# EasyEDA Pro project ProPrj_transverter-front-end_2026-04-14.epro, board 2-PCB_PCB_transverter-control-board
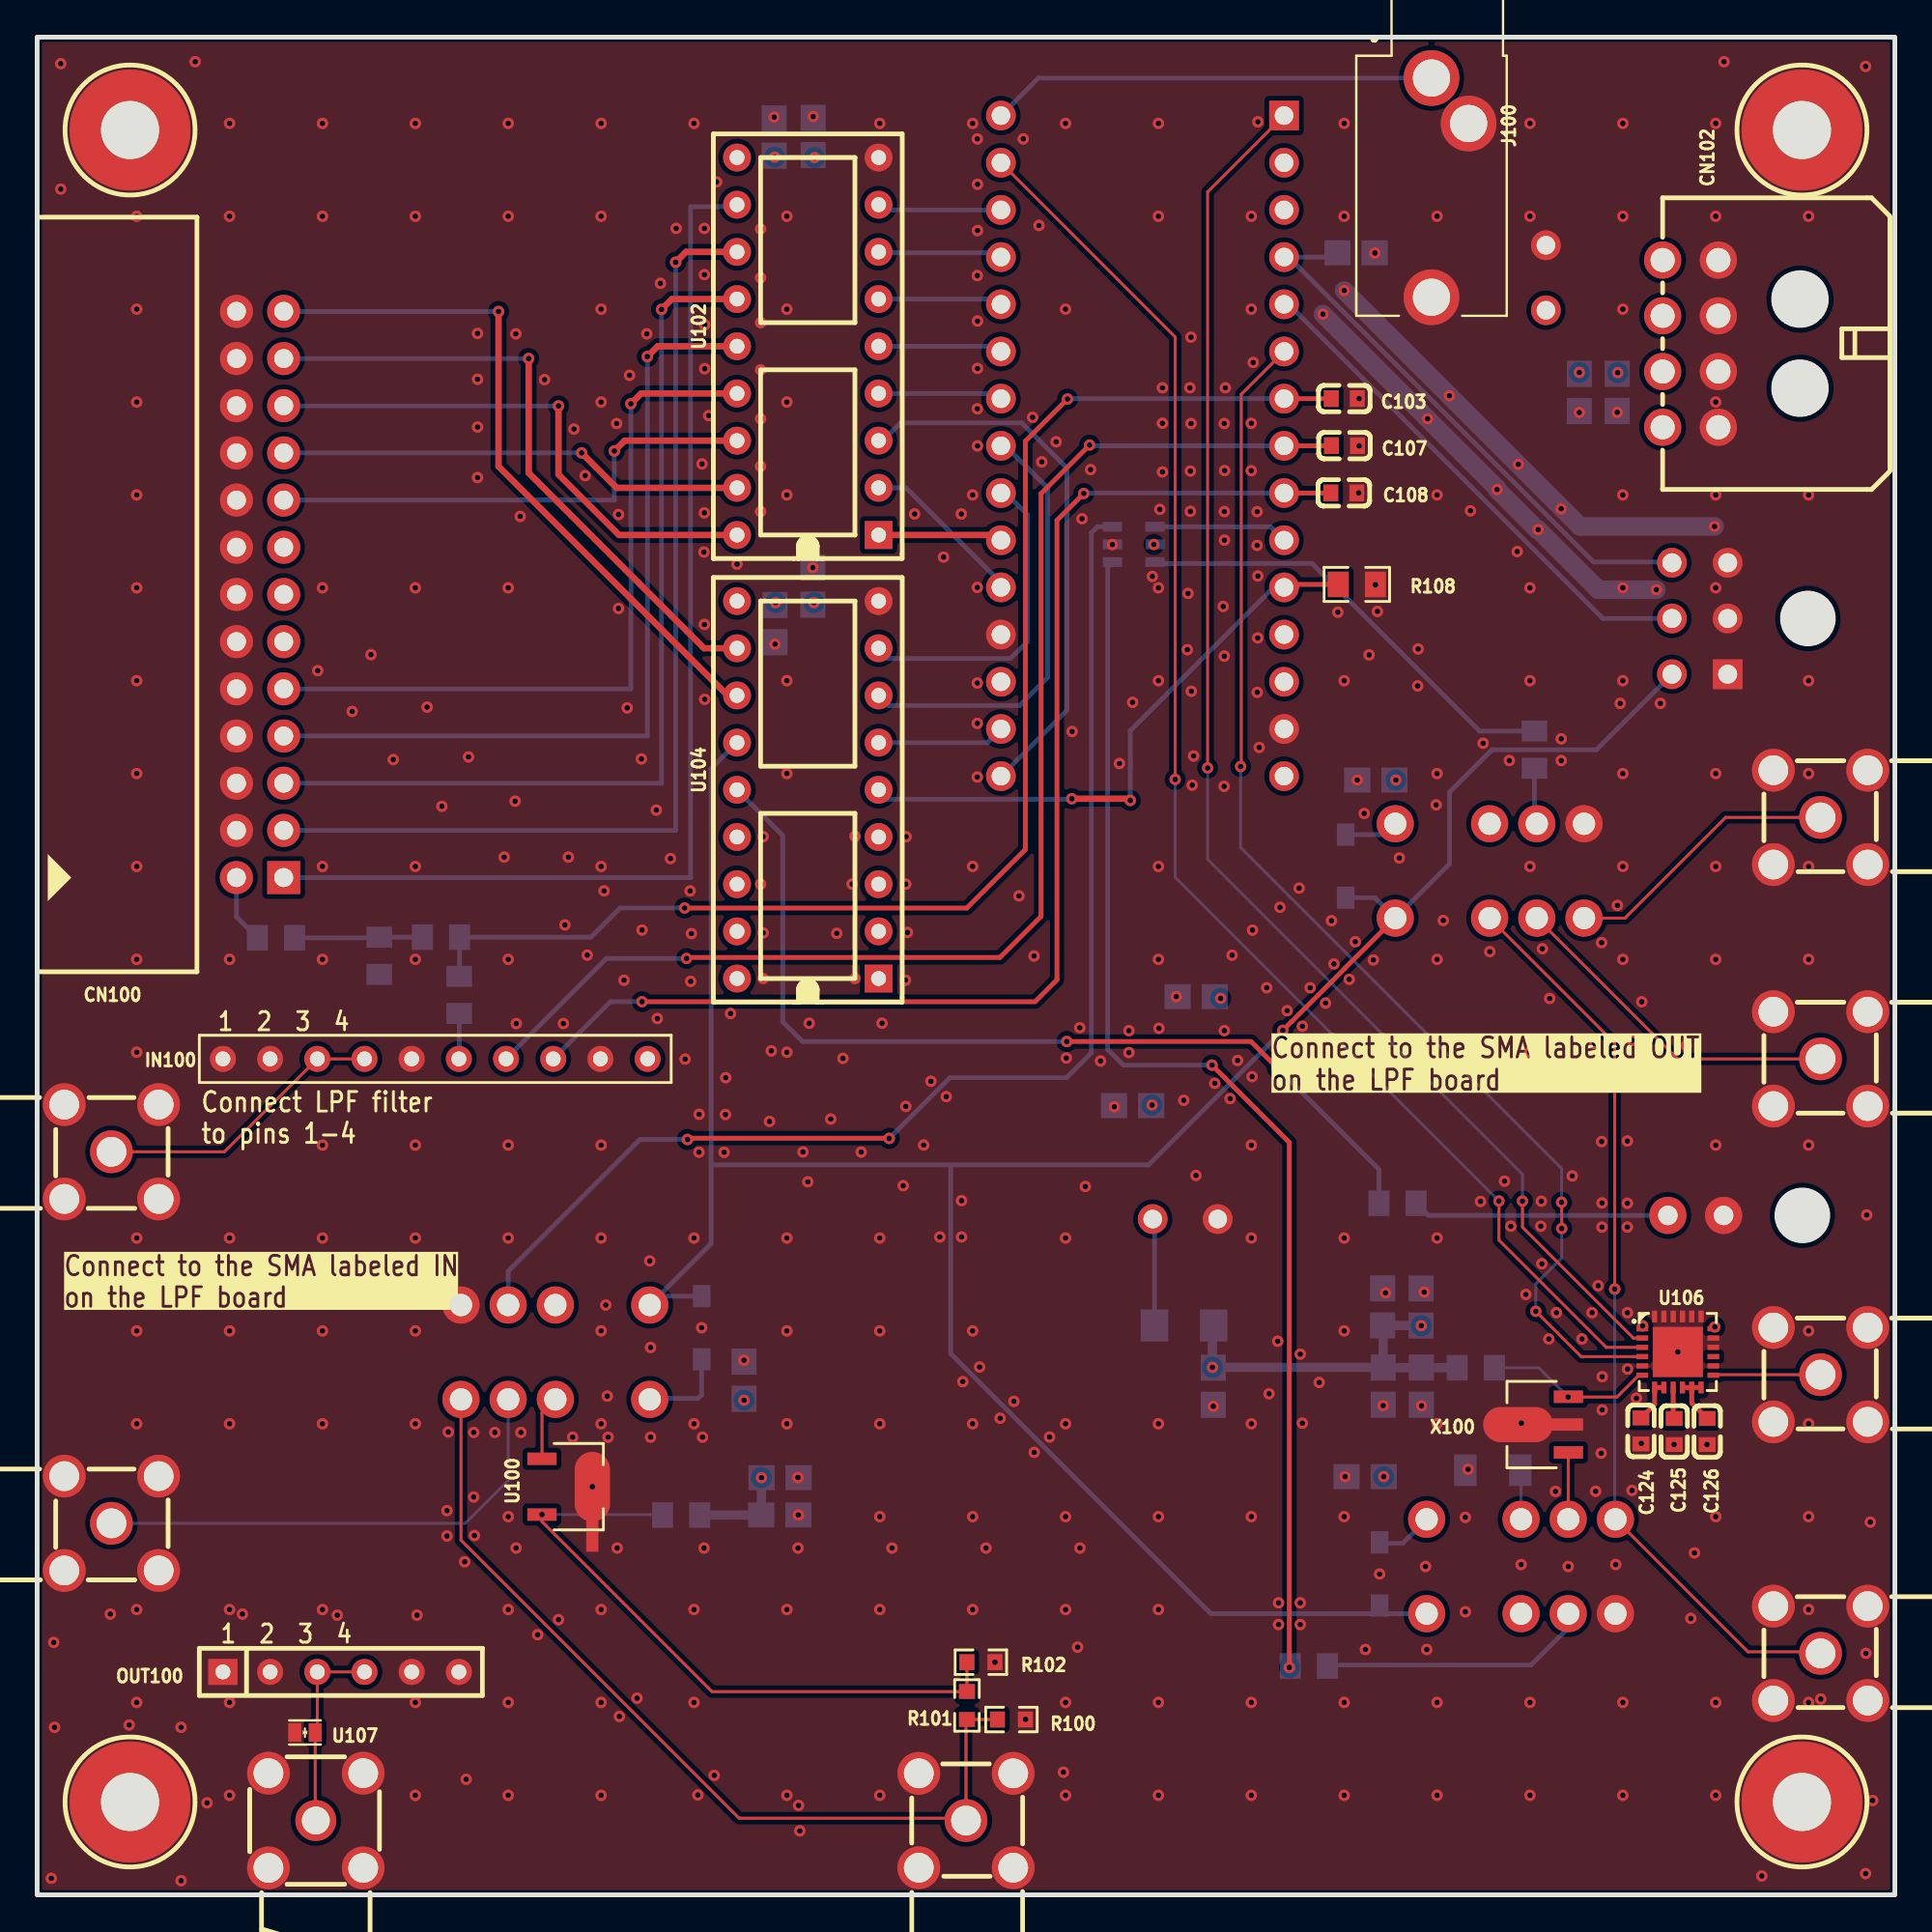
[diagram p11: board, top side]
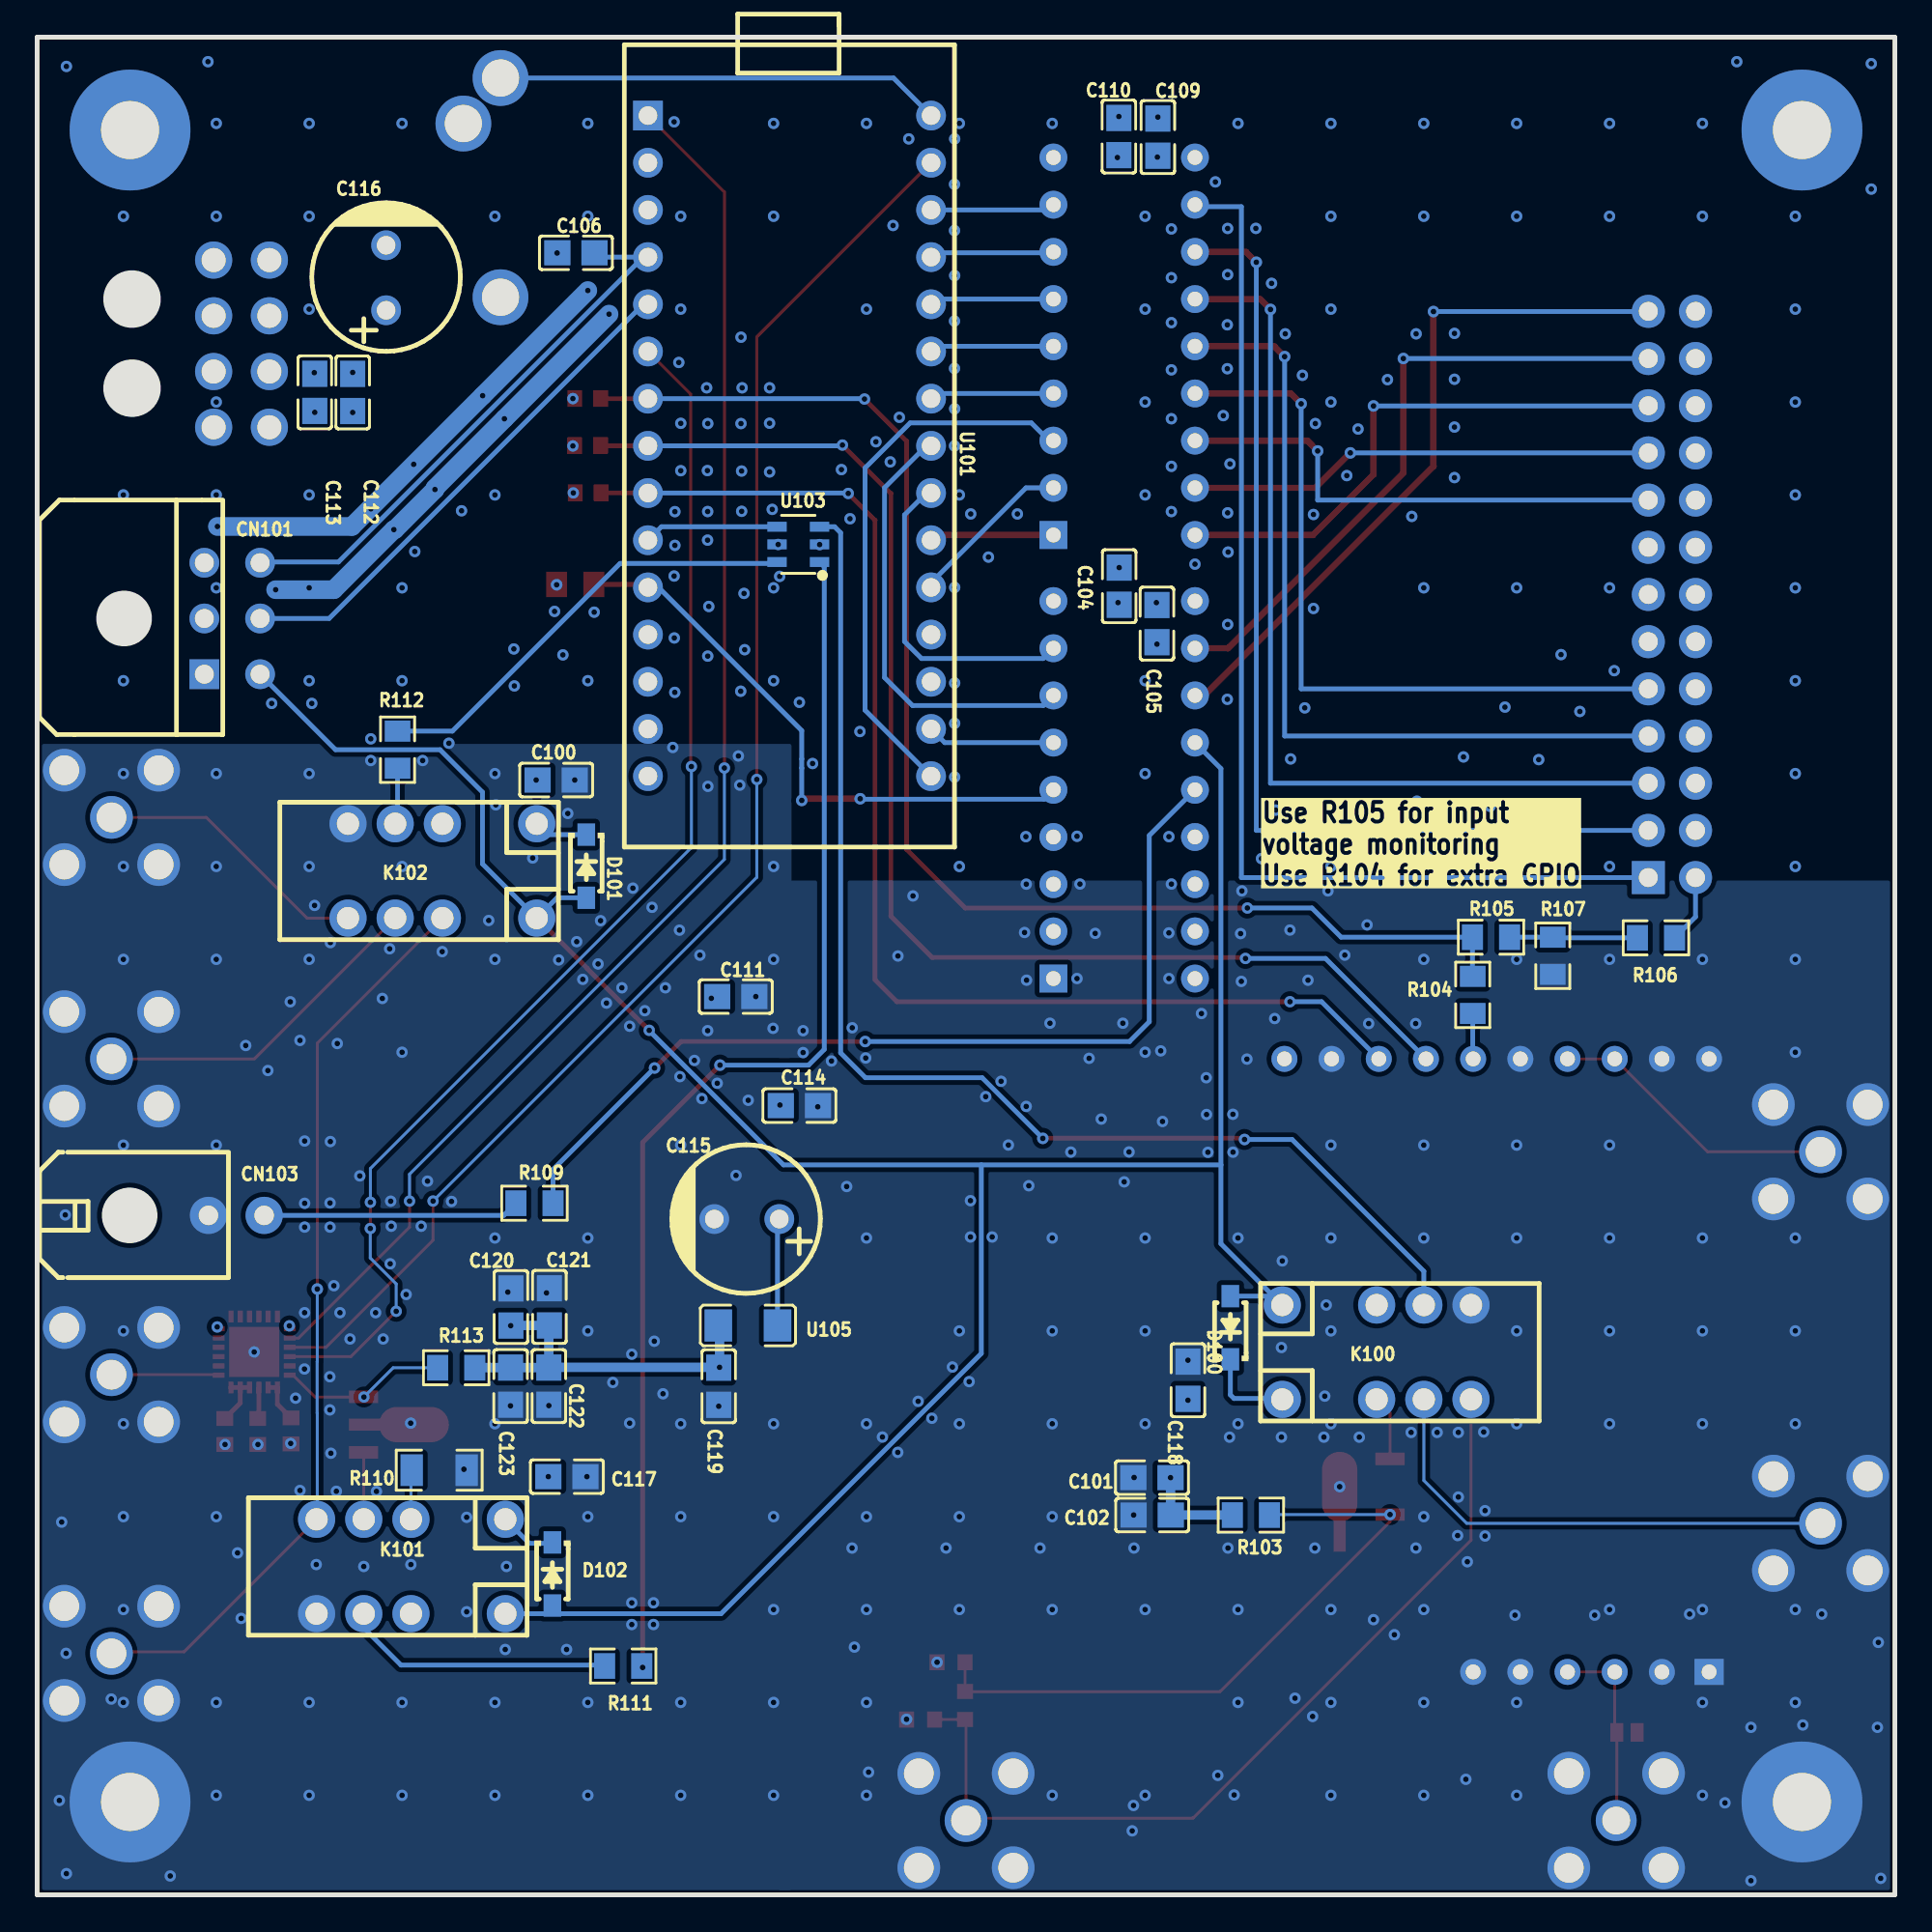
[diagram p12: board, bottom side, seen from below]

Outline 100 x 100 mm; copper layers: Top Layer, Inner1, Inner2, Bottom Layer. Coordinates in mm from the lower left corner of the outline.
Outline path: 0,100 100,100 100,0 0,0 0,100
Stack: Top Layer 0.035mm / Dielectric1 0.48mm PP er 4.5 / Inner1 0.035mm / Dielectric2 0.48mm FR4 er 4.5 / Inner2 0.035mm / Dielectric3 0.48mm PP er 4.5 / Bottom Layer 0.035mm

## Design rules (mm)
net PA-ENABLE-2: control_lines
net PA-ENABLE: control_lines
net RLY-TXRX-EN: control_lines
net TO-BPF: RF
net LO-BPF-SENSE: control_lines
net PA-OUT-SENSE: control_lines
net FROM-BPF: RF
net RLY-5-EN: control_lines
net RLY-4-EN: control_lines
net RLY-3-EN: control_lines
net RLY-2-EN: control_lines
net RLY-1-EN: control_lines
net RLY-6-EN: control_lines
net RLY-7-EN: control_lines
net RLY-8-EN: control_lines
net RLY-9-EN: control_lines
net RLY-10-EN: control_lines
net PA-IN-SENSE: control_lines
net TO-LO: RF
net TO-LPF: RF
net PA-OUTPUT: RF
net FROM-LPF: RF
net TO-ANTENNA: RF
net PA-INPUT-TERMINATION: RF
net LO-BPF-AMP-IN: RF
net LO-BPF-AMP-OUT: RF
net PA-PREAMP-IN: RF
net EXPANSION3: control_lines
net EXPANSION2: control_lines
net EXPANSION1: control_lines
template: User Custom Config
spacing Default (default): track to track 0.152, other pairs 0 to 0.152
spacing RF: track to track 1, other pairs 0 to 0.65
spacing clean_voltage: track to track 0.152, other pairs 0.152 to 0.3
spacing control_lines: track to track 0.5, other pairs 0.152 to 0.3
spacing ground_guard: track to track 0.3, other pairs 0.2 to 0.3
spacing main_power: track to track 2, other pairs 0.152 to 0.3
spacing relay_power: track to track 1, other pairs 0.152 to 0.3
spacing small_components: track to track 0.152, other pairs 0.152 to 0.3
spacing small_power: track to track 0.6, other pairs 0.152 to 0.3
track width Default (default): min 0.254, default 0.254, max 25.4
track width RF: min 0.157, default 0.157, max 0.157
track width control_lines: min 0.25, default 0.25, max 0.26
track width main_power: min 1.5, default 1.5, max 3
track width relay_power: min 1, default 1, max 1.25
track width small_power: min 0.5, default 0.5, max 2.54
differential pair differentialPair (default): width min 0.127, default 0.254, max 2.54; gap min 0.152, default 0.152
via Default (default): diameter min 0.61, default 0.61, max 100.025; hole min 0.305, default 0.305, max 59.995
via RF: diameter min 0.61, default 0.61, max 100.025; hole min 0.305, default 0.305, max 59.995
net class control_lines uses control_lines
net class RF uses RF
net GND uses direct
net PA-ENABLE-2 uses control_lines
net PA-ENABLE uses control_lines
net RLY-TXRX-EN uses control_lines
net LO-TRIM uses control_lines
net TO-BPF uses RF
net LO-BPF-SENSE uses control_lines
net PA-OUT-SENSE uses control_lines
net FROM-BPF uses RF
net PA-INPUT uses RF
net RLY-5-EN uses control_lines
net RLY-4-EN uses control_lines
net RLY-3-EN uses control_lines
net RLY-2-EN uses control_lines
net RLY-1-EN uses control_lines
net RLY-6-EN uses control_lines
net RLY-7-EN uses control_lines
net RLY-8-EN uses control_lines
net RLY-9-EN uses control_lines
net RLY-10-EN uses control_lines
net PA-IN-SENSE uses control_lines
net TO-LO uses RF
net TO-LPF uses RF
net PA-OUTPUT uses RF
net FROM-LPF uses RF
net TO-ANTENNA uses RF
net PA-INPUT-TERMINATION uses RF
net LO-BPF-AMP-IN uses RF
net LO-BPF-AMP-OUT uses RF
net PA-PREAMP-IN uses RF
net PA-PREAMP-OUT uses RF
net SPI-CLK uses RF, small_components
net SPI-CS1 uses RF, small_components
net SPI-MOSI uses RF, small_components
net CONDITIONED-5V uses small_power
net EXPANSION3 uses control_lines
net EXPANSION2 uses control_lines
net EXPANSION1 uses control_lines
['net class', 'rf'] ['NET', 'GND'] uses ground_guard

## Placement (name value [footprint] x y rotation side)
C100  100nF  [C0805]  72.06 60.01 180 bottom
C101  100nF  [C0805]  39.99 22.46 0 bottom
C102  1nF  [C0805]  39.98 20.45 180 bottom
C103  100nF  [C0603]  70.36 80.54 180 top
C104  1nF  [C0805]  41.75 70.45 270 bottom
C105  100nF  [C0805]  39.72 68.43 270 bottom
C106  10nF  [C0805]  71 88.39 0 bottom
C107  100nF  [C0603]  70.37 78.01 180 top
C108  100nF  [C0603]  70.34 75.47 180 top
C109  1nF  [C0805]  39.67 94.62 270 bottom
C110  100nF  [C0805]  41.77 94.65 90 bottom
C111  1nF  [C0805]  62.39 48.35 0 bottom
C112  1uF  [C0805]  83.02 80.87 270 bottom
C113  1nF  [C0805]  85.06 80.88 90 bottom
C114  1uF  [C0805]  58.97 42.49 180 bottom
C115  47 µF  [CAP-TH_BD8.0-P3.50-D0.6-FD]  61.8 36.38 0 bottom
C116  47 µF  [CAP-TH_BD8.0-P3.50-D0.6-FD]  81.22 87.05 90 bottom
C117  100nF  [C0805]  71.48 22.51 180 bottom
C118  100nF  [C0805]  38.05 27.7 90 bottom
C119  10uF  [C0805]  63.31 27.38 90 bottom
C120  1nF  [C0805]  74.5 31.64 270 bottom
C121  100nF  [C0805]  72.43 31.65 90 bottom
C122  1nF  [C0805]  72.46 27.38 90 bottom
C123  100nF  [C0805]  74.51 27.38 270 bottom
C124  330pF  [C0603]  86.33 24.97 90 top
C125  330pF  [C0603]  88.12 24.94 90 top
C126  330pF  [C0603]  89.9 24.94 90 top
CN100  SBH11-PBPC-D13-RA-BK  [IDC-TH_26P-P2.54-H-M-R2-C13-W8.8]  12 70 270 top
CN101  430450602  [CONN-TH_6P-P3.00_43045-0600]  89.5 68.71 270 bottom
CN102  4x2 Connector  [CONN-TH_0430450800]  89 83.5 90 top
CN103  1x2 Connector  [CONN-TH_43045-0200]  89.28 36.58 270 bottom
D100  1N4148W-7-F  [SOD-123_L2.7-W1.6-LS3.7-RD-1]  35.77 30.53 90 bottom
D101  1N4148W-7-F  [SOD-123_L2.7-W1.6-LS3.7-RD-1]  70.44 55.37 270 bottom
D102  1N4148W-7-F  [SOD-123_L2.7-W1.6-LS3.7-RD-1]  72.26 17.27 270 bottom
IN100  X5511FV-10-C30D743-0743  [HDR-TH_10P-P2.54-V-F-S2.54]  21.43 45 0 top
J100  footswitch_in  [SWITCHCRAFT_35RAPC2AVN4]  75.06 94 270 top
K100  TX2-5V  [RELAY-TH_TX2-3V]  27.89 29.21 180 bottom
K101  TX2-5V  [RELAY-TH_TX2-3V]  79.88 17.68 0 bottom
K102  TX2-5V  [RELAY-TH_TX2-3V]  78.19 55.12 0 bottom
NOREF  -  [Pad_e3389]  95 5 0 top
NOREF#2  -  [Pad_e3391]  5 95 0 top
NOREF#3  -  [Pad_e3390]  95 95 0 top
NOREF#4  -  [Pad_e2279]  5 5 0 top
OUT100  X5511FV-06-C30D743-0743  [HDR-TH_6P-P2.54_X5511FV-06-C30D743-0743]  16.35 12 0 top
R100  71.5Ω  [R0603_NEW]  52.45 9.44 180 top
R101  137Ω  [R0603_NEW]  50.05 10.19 270 top
R102  71.5Ω  [R0603_NEW]  50.8 12.52 180 top
R103  0Ω  [R0805]  34.66 20.44 0 bottom
R104  0Ω  [R0805]  22.72 48.44 90 bottom
R105  0Ω  [R0805]  21.74 51.55 0 bottom
R106  22kΩ  [R0805]  12.86 51.52 180 bottom
R107  10kΩ  [R0805]  18.41 50.55 90 bottom
R108  100k  [R0805]  71.04 70.54 0 top
R109  100  [R0805]  73.23 37.23 0 bottom
R110  50Ω  [R1206]  78.36 22.86 0 bottom
R111  1k  [R0805]  68.45 12.32 180 bottom
R112  1k  [R0805]  80.6 61.64 270 bottom
R113  0Ω  [R0805]  77.44 28.37 180 bottom
SMA100  LO  [ANT-TH_SMA-J-P-H-RA-TH1]  50 4 90 top
SMA101  BPF-IN  [ANT-TH_SMA-J-P-H-RA-TH1]  4 20 0 top
SMA102  BPF-OUT  [ANT-TH_SMA-J-P-H-RA-TH1]  96 13 180 top
SMA103  LPF-IN  [ANT-TH_SMA-J-P-H-RA-TH1]  96 45 180 top
SMA104  LPF-OUT  [ANT-TH_SMA-J-P-H-RA-TH1]  4 40 0 top
SMA105  ANTENNA  [SMA-TH_CONSMA002-L-G]  15 4 270 top
SMA106  PA-IN  [ANT-TH_SMA-J-P-H-RA-TH1]  96 28 180 top
SMA107  PA-OUT  [ANT-TH_SMA-J-P-H-RA-TH1]  96 58 180 top
U100  GALI-74+  [SOT-89-3_L4.5-W2.5-P1.50-LS4.2-BR]  28.53 21.97 180 top
U101  ABX00142  [ARDUINO-TH_L43.2-W17.8-P2.54-LS15.24-BL]  59.5 78 270 bottom
U102  4818-3000-CP  [DIP-18_L22.9-W10.2-P2.54-LS7.6-BL_100-183-100-1001-00]  41.48 83.36 90 top
U103  74LVC1G11W6-7  [SOT-26_L3.0-W1.6-P0.95-LS2.8-BL]  59.03 72.7 90 bottom
U104  4818-3000-CP  [DIP-18_L22.9-W10.2-P2.54-LS7.6-BL_100-183-100-1001-00]  41.48 59.48 90 top
U105  BLM31PG601SH1L  [L1206]  61.74 30.65 0 bottom
U106  HMC792ALP4E  [QFN-24_L4.0-W4.0-P0.50-TL-EP2.7]  88.32 29.22 0 top
U107  CPDUR5V0R-HF  [SOD-523F_L1.7-W1.0-BI]  14.42 8.74 0 top
X100  GALI-52+  [SOT-89-3_L4.5-W2.5-P1.50-LS4.2-BR#2]  81.07 25.31 0 top

## Footprints (pads in the part's own frame, mm; a bottom-side part is the same pattern mirrored in y, then rotated)
ANT-TH_SMA-J-P-H-RA-TH1
  round 2.3 hole 1.6: 1(-2.54,2.54) 2(2.54,2.54) 3(2.54,-2.54) 4(-2.54,-2.54) 5(0,0)
ARDUINO-TH_L43.2-W17.8-P2.54-LS15.24-BL
  rect 1.6x1.6 hole 1: 1(-17.78,-7.62)
  round 1.6 hole 1: 2(-15.24,-7.62) 3(-12.7,-7.62) 4(-10.16,-7.62) 5(-7.62,-7.62) 6(-5.08,-7.62) 7(-2.54,-7.62) 8(0,-7.62) 9(2.54,-7.62) 10(5.08,-7.62) 11(7.62,-7.62) 12(10.16,-7.62) 13(12.7,-7.62) 14(15.24,-7.62) 15(17.78,-7.62) 16(17.78,7.62) 17(15.24,7.62) 18(12.7,7.62) 19(10.16,7.62) 20(7.62,7.62) 21(5.08,7.62) 22(2.54,7.62) 23(0,7.62) 24(-2.54,7.62) 25(-5.08,7.62) 26(-7.62,7.62) 27(-10.16,7.62) 28(-12.7,7.62) 29(-15.24,7.62) 30(-17.78,7.62)
C0603
  rect 0.8x0.9 smd: 1(-0.7,0) 2(0.7,0)
C0805
  rect 1.41x1.35 smd: 1(-1,0) 2(1,0)
CAP-TH_BD8.0-P3.50-D0.6-FD
  round 1.6 hole 1: 1(-1.75,0) 2(1.75,0)
CONN-TH_6P-P3.00_43045-0600
  rect 1.6x1.6 hole 1.02: 1(3,-1.5)
  round 1.6 hole 1.02: 2(0,-1.5) 3(-3,-1.5) 4(3,1.5) 5(0,1.5) 6(-3,1.5)
CONN-TH_43045-0200
  round 2 hole 1.05: 1(0,-1.5) 2(0,1.5)
CONN-TH_0430450800
  round 2 hole 1.3: 1(4.5,-1.5) 2(1.5,-1.5) 3(-1.5,-1.5) 4(-4.5,-1.5) 5(4.5,1.5) 6(1.5,1.5) 7(-1.5,1.5) 8(-4.5,1.5)
DIP-18_L22.9-W10.2-P2.54-LS7.6-BL_100-183-100-1001-00
  rect 1.5x1.5 hole 0.8: 1(-10.16,-3.81)
  round 1.5 hole 0.8: 2(-7.62,-3.81) 3(-5.08,-3.81) 4(-2.54,-3.81) 5(0,-3.81) 6(2.54,-3.81) 7(5.08,-3.81) 8(7.62,-3.81) 9(10.16,-3.81) 10(10.16,3.81) 11(7.62,3.81) 12(5.08,3.81) 13(2.54,3.81) 14(0,3.81) 15(-2.54,3.81) 16(-5.08,3.81) 17(-7.62,3.81) 18(-10.16,3.81)
HDR-TH_6P-P2.54_X5511FV-06-C30D743-0743
  rect 1.575x1.4 hole 0.8: 1(-6.35,0)
  round 1.4 hole 0.8: 2(-3.81,0) 3(-1.27,0) 4(1.27,0) 5(3.81,0) 6(6.35,0)
HDR-TH_10P-P2.54-V-F-S2.54
  round 1.4 hole 0.8: 1(-11.43,0) 2(-8.89,0) 3(-6.35,0) 4(-3.81,0) 5(-1.27,0) 6(1.27,0) 7(3.81,0) 8(6.35,0) 9(8.89,0) 10(11.43,0)
IDC-TH_26P-P2.54-H-M-R2-C13-W8.8
  rect 1.778x1.778 hole 1.02: 1(15.24,1.27)
  round 1.778 hole 1.02: 2(15.24,-1.27) 3(12.7,1.27) 4(12.7,-1.27) 5(10.16,1.27) 6(10.16,-1.27) 7(7.62,1.27) 8(7.62,-1.27) 9(5.08,1.27) 10(5.08,-1.27) 11(2.54,1.27) 12(2.54,-1.27) 13(0,1.27) 14(0,-1.27) 15(-2.54,1.27) 16(-2.54,-1.27) 17(-5.08,1.27) 18(-5.08,-1.27) 19(-7.62,1.27) 20(-7.62,-1.27) 21(-10.16,1.27) 22(-10.16,-1.27) 23(-12.7,1.27) 24(-12.7,-1.27) 25(-15.24,1.27) 26(-15.24,-1.27)
L1206
  rect 1.485x1.728 smd: 1(-1.593,0) 2(1.593,0)
Pad_e2279
  round 6.5 hole 3.125: 1(0,0)
Pad_e3389
  round 6.5 hole 3.125: 1(0,0)
Pad_e3390
  round 6.5 hole 3.125: 1(0,0)
Pad_e3391
  round 6.5 hole 3.125: 1(0,0)
QFN-24_L4.0-W4.0-P0.50-TL-EP2.7
  rect 0.633x0.28 smd: 1(-1.911,1.25) 2(-1.911,0.75) 3(-1.911,0.25) 4(-1.911,-0.25) 5(-1.911,-0.75) 6(-1.911,-1.25) 13(1.911,-1.25) 14(1.911,-0.75) 15(1.911,-0.25) 16(1.911,0.25) 17(1.911,0.75) 18(1.911,1.25)
  rect 0.28x0.633 smd: 7(-1.25,-1.911) 8(-0.75,-1.911) 9(-0.25,-1.911) 10(0.25,-1.911) 11(0.75,-1.911) 12(1.25,-1.911) 19(1.25,1.911) 20(0.75,1.911) 21(0.25,1.911) 22(-0.25,1.911) 23(-0.75,1.911) 24(-1.25,1.911)
  rect 2.7x2.7 smd: 25(0,0)
R0603_NEW
  rect 0.806x0.864 smd: 1(-0.753,0) 2(0.753,0)
R0805
  rect 1.133x1.377 smd: 1(-1,0) 2(1,0)
R1206
  rect 1.208x1.701 smd: 1(-1.479,0) 2(1.479,0)
RELAY-TH_TX2-3V
  round 2 hole 1.2: 1(-5.08,-2.54) 3(0,-2.54) 4(2.54,-2.54) 5(5.08,-2.54) 8(5.08,2.54) 9(2.54,2.54) 10(0,2.54) 12(-5.08,2.54)
SMA-TH_CONSMA002-L-G
  round 2.2 hole 1.5: 1(0,0)
  round 2.3 hole 1.6: 2(-2.55,2.55) 3(-2.55,-2.55) 4(2.55,-2.55) 5(2.55,2.55)
SOD-123_L2.7-W1.6-LS3.7-RD-1
  rect 1.2x0.95 smd: 1(-1.7,0) 2(1.7,0)
SOD-523F_L1.7-W1.0-BI
  rect 0.7x1 smd: 1(-0.55,0) 2(0.55,0)
SOT-26_L3.0-W1.6-P0.95-LS2.8-BL
  rect 0.532x1.04 smd: 1(-0.95,-1.145) 2(0,-1.145) 3(0.95,-1.145) 4(0.95,1.145) 5(0,1.145) 6(-0.95,1.145)
SOT-89-3_L4.5-W2.5-P1.50-LS4.2-BR
  rect 1.575x0.672 smd: 1(1.356,-1.5) 3(1.356,1.5)
  custom 1.9x5.377 smd: 2(-1.356,0)
SOT-89-3_L4.5-W2.5-P1.50-LS4.2-BR#2
  rect 1.575x0.672 smd: 1(1.356,-1.5) 3(1.356,1.5)
  custom 5.377x1.9 smd: 2(-1.356,0)
SWITCHCRAFT_35RAPC2AVN4
  round 3 hole 2.005x2: 1(-3.8,0) 2(-1.35,2) 5(8,0)

## Nets
As in the schematic, except:
GND: C100.2 C101.2 C102.1 C103.1 C104.1 C105.2 C106.2 C107.1 C108.1 C109.1 C110.2 C111.1 C112.2 C113.1 C114.2 C115.2 C116.2 C117.2 C118.2 C119.1 C120.1 C121.2 C122.1 C123.2 C124.1 C125.1 C126.1 CN100.4 CN100.6 CN100.8 CN100.10 CN100.12 CN100.14 CN100.16 CN100.18 CN100.20 CN100.22 CN100.24 CN100.26 CN101.1 CN101.2 CN101.3 CN102.1 CN102.2 CN102.3 CN102.4 CN103.1 IN100.1 IN100.2 IN100.5 IN100.9 J100.2 J100.5 K100.8 K101.8 K102.5 NOREF.1 NOREF#2.1 NOREF#3.1 NOREF#4.1 OUT100.1 OUT100.2 OUT100.5 OUT100.6 R100.1 R102.1 R107.1 R108.2 R110.1 SMA100.1 SMA100.2 SMA100.3 SMA100.4 SMA101.1 SMA101.2 SMA101.3 SMA101.4 SMA102.1 SMA102.2 SMA102.3 SMA102.4 SMA103.1 SMA103.2 SMA103.3 SMA103.4 SMA104.1 SMA104.2 SMA104.3 SMA104.4 SMA105.2 SMA105.3 SMA105.4 SMA105.5 SMA106.1 SMA106.2 SMA106.3 SMA106.4 SMA107.1 SMA107.2 SMA107.3 SMA107.4 U100.2 U101.14 U101.19 U102.9 U103.2 U104.9 U106.5 U106.14 U106.16 U106.17 U106.19 U106.20 U106.21 U106.22 U106.23 U106.24 U106.25 U107.1 X100.2

Pads without a net: CN102 5 6; U101 2 3 13 15 18; U104 1 2 3 4 15 16 17 18; U106 15

## Via types
v1: diameter 0.61, hole 0.305, Top Layer to Bottom Layer, 575 vias
v2: diameter 0.62, hole 0.31, Top Layer to Bottom Layer, 28 vias

## Routing (per net, layer and track width the routed paths; a pad name or vN(x,y) marks a point on that pad's centre or on a via; arc(x,y) is an arc through that point)
2.5V-REF-EN: length 27.9
  Bottom Layer w0.254: U101.5 67.37,85.62 84.28,68.71 CN101.5
12V-SENSE: length 6.9
  Bottom Layer w0.254: R106.1 18.38,51.52 R107.2 20.74,51.55 R105.1
GND: length 49.3
  Bottom Layer w1: v1(70.36,86.36) v1(76.02,80.7) 83.06,73.66 v1(90.3,73.66) ; v1(69.22,85.09) v1(74.85,79.46) 78.59,75.72 v1(78.59,75.65) 80.74,73.49 v1(80.8,73.49) 84.03,70.26 v1(87.16,70.26)
  vias: v1(0.76,0.89) v1(0.89,13.59) v1(0.94,9.02) v1(1.27,98.57) v1(1.27,91.82) v1(3.94,15.11) v1(4.95,9.14) v1(5.36,90.36) v1(5.36,85.36) v1(5.36,80.36) v1(5.36,75.36) v1(5.36,70.36) v1(5.36,65.36) v1(5.36,60.36) v1(5.36,55.36) v1(5.36,50.36) v1(5.36,45.36) v1(5.36,35.36) v1(5.36,30.36) v1(5.36,25.36) v1(5.36,15.36) v1(5.36,10.36) v1(7.75,9.02) v1(7.75,0.76) v1(8.51,98.68) v1(9.14,4.95) v1(10.36,95.36) v1(10.36,90.36) v1(10.36,50.36) v1(10.36,35.36) v1(10.36,30.36) v1(10.36,25.36) v1(10.36,15.36) v1(10.36,10.36) v1(10.36,5.36) v1(11.05,15.11) v1(15.1,65.9) v1(15.36,95.36) v1(15.36,90.36) v1(15.36,70.36) v1(15.36,55.36) v1(15.36,50.36) v1(15.36,40.36) v1(15.36,35.36) v1(15.36,30.36) v1(15.36,25.36) v1(15.36,15.36) v1(16.16,15.06) v1(16.96,63.7) v1(17.97,66.76) v1(19.17,61.11) v1(20.36,95.36) v1(20.36,90.36) v1(20.36,70.36) v1(20.36,55.36) v1(20.36,50.36) v1(20.36,40.36) v1(20.36,35.36) v1(20.36,30.36) v1(20.36,25.36) v1(20.45,15.06) v1(20.36,10.36) v1(20.36,5.36) v1(20.99,63.94) v1(21.79,58.6) v1(22.13,24.92) v1(22.06,20.68) v1(22.06,19.32) v1(23.01,17.93) v1(23.09,6.22) v1(23.22,61.25) v1(23.5,24.89) v1(23.5,21.41) v1(23.54,19.34) v1(23.71,84.05) v1(23.71,81.58) v1(23.71,79.01) v1(23.71,76.29) v1(24.64,24.89) v1(25.14,55.86) v1(25.36,95.36) v1(25.36,90.36) v1(25.36,70.36) v1(25.36,50.36) v1(25.36,40.36) v1(25.36,35.36) v1(25.36,20.36) v1(25.36,15.36) v1(25.36,10.36) v1(25.36,5.36) v1(25.73,58.87) v1(25.77,84.03) v1(25.79,46.9) v1(25.78,18.67) v1(26,74.2) v1(26.04,24.89) v1(26.94,14) v1(27.31,81.56) v1(28.06,14.81) v1(28.32,46.9) v1(28.41,52.21) v1(28.6,55.86) v1(28.83,24.64) v1(28.9,78.91) v1(29.5,76.4) v1(29.61,50.59) v1(30.36,95.36) v1(30.36,90.36) v1(30.36,85.36) v1(30.36,80.36) v1(30.36,55.36) v1(30.36,40.36) v1(30.36,35.36) v1(30.36,30.36) v1(30.36,25.36) v1(30.36,15.36) v1(30.36,10.36) v1(30.36,5.36) v1(30.52,54.04) v1(30.61,31.75) v1(30.69,26.85) v1(30.73,24.64) v1(31.19,79.2) v1(31.22,18.67) v1(31.3,74.3) v1(31.3,69.25) v1(31.34,9.6) v1(31.59,49.24) v1(31.76,63.89) v1(31.89,81.8) v1(32.29,10.59) v1(32.53,61.15) v1(32.56,51.94) v1(32.81,84.03) v1(32.97,34.12) v1(33.02,29.46) v1(33.02,24.64) v1(33.33,58.39) v1(33.38,47.17) v1(33.55,86.75) v1(34.09,55.78) v1(34.4,89.71) v1(34.88,44.99) v1(35.15,54.04) v1(35.22,51.74) v1(35.18,49.17) v1(35.36,95.36) v1(35.36,35.36) v1(35.36,25.36) v1(35.36,15.36) v1(35.36,10.36) v1(35.63,42.02) v1(35.63,39.98) v1(35.57,5.38) v1(35.79,77.03) v1(35.77,30.53) v1(35.81,24.64) v1(35.92,89.7) v1(35.92,87.22) v1(35.93,84.52) v1(35.93,82.15) v1(35.92,74.39) v1(35.89,72.28) v1(35.92,68.38) v1(35.93,64.36) v1(35.9,18.67) v1(36.15,79.63) v1(36.45,6.43) v1(36.58,92.21) v1(36.98,39.97) v1(37.07,43.99) v1(37.05,42.01) v1(37.33,47.44) v1(37.67,71.63) v1(38.05,28.78) v1(38.94,89.68) v1(38.94,87.05) v1(38.94,84.63) v1(38.94,82.09) v1(38.94,79.46) v1(38.94,76.9) v1(38.94,74.46) v1(38.94,54.41) v1(39.08,56.96) v1(39.08,51.78) v1(39.08,49.33) v1(39.42,41.63) v1(39.52,45.43) v1(39.67,95.7) v1(39.72,67.32) v1(40.36,90.36) v1(40.36,85.36) v1(40.36,80.36) v1(40.36,75.36) v1(40.36,65.36) v1(40.36,60.36) v1(40.36,45.36) v1(40.36,35.36) v1(40.36,30.36) v1(40.36,25.36) v1(40.36,15.36) v1(40.36,5.36) v1(40.96,18.67) v1(40.99,4.81) v1(41.05,3.44) v1(41.22,39.99) v1(41.48,38.38) v1(41.56,46.92) v1(41.77,95.73) v1(41.75,71.45) v1(42.72,41.76) v1(43.04,51.76) v1(43.37,45.03) v1(43.87,54.41) v1(44.02,56.98) v1(44.02,49.33) v1(44.36,39.98) v1(45.36,95.36) v1(45.36,35.36) v1(45.36,30.36) v1(45.36,25.36) v1(45.36,20.36) v1(45.36,15.36) v1(45.36,5.36) v1(45.48,46.92) v1(46.02,18.67) v1(46.62,38.17) v1(46.74,49.24) v1(46.78,56.96) v1(46.76,54.41) v1(46.85,51.8) v1(46.76,42.44) v1(47.23,74.33) v1(47.72,40.36) v1(48.11,43.79) v1(48.59,35.41) v1(48.79,72.01) v1(48.94,42.97) v1(49.75,74.33) v1(49.76,37.37) v1(49.76,35.41) v1(49.83,27.63) v1(50.36,95.36) v1(50.36,75.36) v1(50.36,55.36) v1(50.36,30.36) v1(50.36,25.36) v1(50.36,20.36) v1(50.36,15.36) v1(50.61,94.52) v1(50.62,92.08) v1(50.62,89.59) v1(50.61,87.17) v1(50.62,84.72) v1(50.62,82.17) v1(50.61,80) v1(50.62,78) v1(50.61,70.38) v1(50.61,65.23) v1(50.61,63.06) v1(50.61,60.17) v1(50.73,28.41) v1(51.07,18.67) v1(51.84,25.65) v1(52.58,26.57) v1(52.85,53.77) v1(53.08,94.52) v1(53.59,79.54) v1(53.66,50.54) v1(53.67,23.82) v1(53.93,89.86) v1(54.08,77.14) v1(54.5,24.65) v1(54.85,78.22) v1(55.25,6.6) v1(55.36,95.36) v1(55.36,85.36) v1(55.4,45.05) v1(55.36,35.36) v1(55.36,25.36) v1(55.36,20.36) v1(55.36,15.36) v1(55.36,10.36) v1(55.36,5.36) v1(55.71,62.62) v1(56.01,13.34) v1(56.12,46.67) v1(56.13,18.67) v1(56.24,74.08) v1(56.42,38.13) v1(56.71,76.72) v1(57.24,44.89) v1(57.88,72.68) v1(57.98,42.42) v1(58.26,60.9) v1(58.77,46.52) v1(58.77,45.34) v1(58.97,64.19) v1(60.03,70.97) v1(60.36,95.36) v1(60.36,90.36) v1(60.43,74.58) v1(60.36,70.36) v1(60.36,65.36) v1(60.36,55.36) v1(60.36,50.36) v1(60.39,46.64) v1(60.36,25.36) v1(60.36,20.36) v1(60.36,15.36) v1(60.36,10.36) v1(60.36,5.36) v1(60.57,81.12) v1(60.57,79.22) v1(60.57,76.6) v1(61.32,48.35) v1(61.72,42.77) v1(61.95,70.06) v1(61.91,67.03) v1(62.11,83.85) v1(62.05,81.12) v1(62.11,79.2) v1(62.08,76.64) v1(62.08,74.48) v1(62.13,64.79) v1(62.18,59.74) v1(62.25,61.31) v1(62.38,38.73) v1(63.31,26.3) v1(63.39,43.69) v1(63.85,69.35) v1(63.9,79.2) v1(63.92,76.67) v1(63.91,74.46) v1(63.91,72.92) v1(63.9,66.68) v1(63.89,59.67) v1(63.91,46.52) v1(63.96,81.12) v1(64.22,42.86) v1(64.32,50.58) v1(64.62,44.92) v1(65.36,90.36) v1(65.36,85.36) v1(65.35,79.21) v1(65.35,76.66) v1(65.42,51.93) v1(65.4,44.05) v1(65.36,40.36) v1(65.36,35.36) v1(65.36,25.36) v1(65.36,20.36) v1(65.36,10.36) v1(65.36,5.36) v1(65.46,82.49) v1(65.71,95.44) v1(65.67,74.46) v1(65.67,72.64) v1(65.71,70.99) v1(65.7,67.66) v1(65.68,64.73) v1(65.78,61.76) v1(66.18,48.83) v1(66.31,26.97) v1(66.78,29.8) v1(66.82,15.72) v1(66.82,14.55) v1(66.9,53.16) v1(67.29,47.59) v1(67.93,54.19) v1(67.99,29.1) v1(67.99,15.72) v1(67.99,14.55) v1(68.11,46.76) v1(68.11,25.39) v1(68.52,48.83) v1(69.01,27.58) v1(69.35,48) v1(69.67,52.44) v1(69.81,50.11) v1(70.01,69.05) v1(70.36,95.36) v1(70.36,90.36) v1(70.36,65.36) v1(70.36,35.36) v1(70.36,30.36) v1(70.41,22.51) v1(70.36,20.36) v1(70.36,10.36) v1(70.36,5.36) v1(70.63,49.28) v1(70.96,51.31) v1(71.14,75.47) v1(71.06,60.01) v1(71.16,80.54) v1(71.16,77.99) v1(71.44,58.21) v1(71.5,13.21) v1(71.7,66.75) v1(71.93,50.33) v1(72.15,69.09) v1(72.26,17.27) v1(72.46,26.34) v1(72.58,32.4) v1(73.33,55.81) v1(74.34,67.07) v1(74.31,65.08) v1(74.52,26.32) v1(74.66,32.45) v1(74.74,17.68) v1(74.8,13.21) v1(75.31,58.67) v1(75.36,90.36) v1(75.36,75.36) v1(75.36,60.36) v1(75.36,50.36) v1(75.36,35.36) v1(75.36,25.36) v1(75.36,10.36) v1(75.36,5.36) v1(75.69,52.45) v1(76.88,20.32) v1(76.88,15.24) v1(77.15,74.5) v1(77.69,37.33) v1(77.84,61.99) v1(78.2,50.77) v1(78.99,38.42) v1(79.25,61.06) v1(79.33,35.99) v1(79.73,77) v1(79.67,72.31) v1(79.88,17.78) v1(80.14,32.32) v1(80.36,95.36) v1(80.36,90.36) v1(80.36,70.36) v1(80.36,65.36) v1(80.36,55.36) v1(80.36,45.36) v1(80.36,10.36) v1(80.36,5.36) v1(80.94,35.99) v1(81.03,50.93) v1(80.97,37.34) v1(81,33.97) v1(81.42,48.25) v1(81.37,29.92) v1(81.74,21.72) v1(81.78,31.34) v1(82.04,74.61) v1(82.04,62.23) v1(82.04,61.06) v1(82.42,17.68) v1(82.63,38.7) v1(83.02,79.8) v1(83.16,29.92) v1(83.7,31.34) v1(83.84,45.83) v1(83.89,21.72) v1(84.03,32.79) v1(84.22,51.26) v1(84.22,40.55) v1(84.23,37.24) v1(84.23,35.94) v1(84.24,27.89) v1(84.24,26.11) v1(84.19,23.77) v1(84.98,17.78) v1(85.06,79.8) v1(85.07,53.26) v1(85.22,64.14) v1(85.36,95.36) v1(85.36,90.36) v1(85.36,85.36) v1(85.36,75.36) v1(85.36,70.36) v1(85.36,65.36) v1(85.36,60.36) v1(85.36,55.36) v1(85.36,50.36) v1(85.36,10.36) v1(85.36,5.36) v1(85.6,40.58) v1(85.6,37.23) v1(85.6,35.94) v1(85.6,31.34) v1(85.61,28.31) v1(85.85,46) v1(85.85,21.77) v1(86.09,26.74) v1(86.38,48.07) v1(86.35,24.3) v1(87.38,64.14) v1(87.58,44.37) v1(88.12,24.24) v1(88.32,29.22) v1(88.77,45.72) v1(89.02,14.88) v1(89.21,18.41) v1(89.89,24.24) v1(90.36,95.36) v1(90.36,90.36) v1(90.36,80.36) v1(90.36,75.36) v1(90.36,70.36) v1(90.36,60.36) v1(90.36,55.36) v1(90.36,50.36) v1(90.36,40.36) v1(90.36,20.36) v1(90.36,10.36) v1(90.36,5.36) v1(90.81,98.68) v1(92.84,1.02) v1(95.36,90.36) v1(95.36,75.36) v1(95.36,65.36) v1(95.36,60.36) v1(95.36,55.36) v1(95.36,50.36) v1(95.36,40.36) v1(95.36,30.36) v1(95.36,25.36) v1(95.36,20.36) v1(95.36,15.36) v1(95.36,10.36) v1(96.01,10.54) v1(98.43,98.42) v1(98.44,13) v1(98.43,1.14) v1(98.49,36.6) v1(98.68,20.07) v1(98.81,5.08) v2(29.89,21.97) v2(40.95,22.47) v2(40.98,20.45) v2(51.56,12.52) v2(53.2,9.45) v2(72.01,88.38) v2(72.04,70.52) v2(77.03,22.91) v2(79.89,25.39)
$C124_2: length 2.4
  Top Layer w0.254: U106.8 U106.7 87.07,26.41 C124.2
$C125_2: length 1.7
  Top Layer w0.254: U106.9 88.07,25.7 C125.2
$C126_2: length 3
  Top Layer w0.254: U106.11 89.07,26.47 C126.2 ; U106.11 U106.10 ; U106.11 U106.12
$J100_1: length 24
  Bottom Layer w0.254: J100.1 53.9,97.8 U101.30
$K101_9: length 14.7
  Bottom Layer w0.254: R111.1 69.5,12.37 80.41,12.37 82.55,14.5 82.55,15.01 K101.9
$K102_4: length 3
  Bottom Layer w0.254: R112.2 80.6,57.78 K102.4
$R108_1: length 32
  Top Layer w0.254: R108.1 67.28,70.54 U101.11
  Top Layer w0.342: v2(58.84,58.91) 58.75,59 v2(55.7,59)
  Bottom Layer w0.254: U101.11 66.55,70.38 58.84,62.67 58.84,61.14 58.84,61.14 58.84,60.66 58.84,60.66 v2(58.84,58.91) ; U104.5 45.8,58.98 55.67,58.98 v2(55.7,59)
$U101_10: length 7.2
  Bottom Layer w0.254: U103.4 66.39,73.65 U101.10
$U101_16: length 29.6
  Bottom Layer w0.254: U101.16 55.43,63.77 55.43,76.81 53.01,79.24 46.48,79.24 45.57,78.32 45.34,78.32 U102.3
$U101_17: length 6.9
  Bottom Layer w0.254: U101.17 51.15,62.03 U104.6
$U101_20: length 8.7
  Bottom Layer w0.254: 51.9,70.61 46.77,75.74 U102.2
$U101_21: length 6.6
  Top Layer w0.342: 45.29,73.2 51.85,73.2 51.9,73.15
$U101_22: length 17.4
  Bottom Layer w0.254: U104.8 45.85,66.55 52.39,66.55 53.31,67.47 53.31,74.28 51.9,75.69
$U101_23: length 23.7
  Bottom Layer w0.254: U104.7 45.84,64.02 52.88,64.02 54.38,65.53 54.38,75.75 51.9,78.23
$U101_24: length 6.6
  Bottom Layer w0.254: 51.9,80.77 51.85,80.82 U102.4
$U101_25: length 6.6
  Bottom Layer w0.254: 51.9,83.31 51.85,83.36 U102.5
$U101_26: length 6.6
  Bottom Layer w0.254: 45.29,85.9 51.85,85.9 51.9,85.85
$U101_27: length 6.6
  Bottom Layer w0.254: U102.7 45.34,88.39 51.9,88.39
$U101_28: length 6.7
  Bottom Layer w0.254: U101.28 45.57,90.7 45.29,90.98
CONDITIONED-5V: length 68.3
  Inner2 w0.5: v1(90.31,30.57) 90.25,30.63 v1(86.42,30.63) 74.52,30.63 v1(74.51,30.64) ; v1(38.99,22.46) 38.99,23.14 39.58,23.74 52.59,23.74 57.25,28.4 v1(63.27,28.4)
  Bottom Layer w0.5: C122.2 72.46,30.62 C121.1 74.5,30.65 v1(74.51,30.64) ; C122.2 72.44,28.4 v1(63.27,28.4) 63.27,30.58 U105.2 ; C122.2 C123.1 76.43,28.38 R113.2 ; C102.2 38.99,20.46 v1(38.99,22.46) ; 38.98,20.45 35.5,20.45
EXPANSION1: length 73.9
  Top Layer w0.254: v1(55.46,80.52) 53.2,78.25 53.2,56.27 50.04,53.12 34.86,53.12 v1(34.85,53.12) ; C103.2 69.66,80.54 U101.7
  Bottom Layer w0.254: U101.7 55.48,80.54 v1(55.46,80.52) ; R104.2 22.74,49.46 R105.2 29.81,51.55 31.38,53.12 v1(34.85,53.12)
EXPANSION2: length 71.5
  Top Layer w0.254: C107.2 69.66,78 U101.8 ; v1(34.96,50.41) 35.01,50.46 51.83,50.46 54.04,52.67 54.04,75.43 v1(56.65,78.04)
  Bottom Layer w0.254: U101.8 56.69,78 v1(56.65,78.04) ; v1(34.96,50.41) 30.65,50.41 IN100.7
EXPANSION3: length 69
  Top Layer w0.254: v1(32.56,48.08) 53.72,48.08 54.9,49.26 54.9,74 v1(56.34,75.44) ; C108.2 69.63,75.46 U101.9
  Bottom Layer w0.254: U101.9 56.36,75.46 v1(56.34,75.44) ; IN100.8 30.86,48.08 v1(32.56,48.08)
FROM-BPF: length 49.1
  Top Layer w0.157: K102.10 84.92,45.85 84.92,32.61 v2(84.92,32.61) ; 95.97,13.08 92.09,13.08 K101.5
  Bottom Layer w0.157: K101.5 84.92,20.25 84.92,25.93 84.93,25.94 84.93,28.7 84.92,28.7 v2(84.92,32.61)
FROM-LPF: length 15.7
  Top Layer w0.157: IN100.4 IN100.3 10.08,40 SMA104.5
LO-BPF-AMP-IN: length 3.5
  Top Layer w0.157: U100.1 27.17,25.95 K100.3
LO-BPF-AMP-OUT: length 35
  Top Layer w0.157: R102.2 50.05,12.52 R101.1 50.04,10.94 36.33,10.94 27.17,20.09 27.17,20.47
  Bottom Layer w0.157: 33.5,20.45 33.47,20.47 27.17,20.47
  vias: v2(27.17,20.47)
LO-BPF-SENSE: length 67.4
  Top Layer w0.254: v2(45.87,40.72) 45.85,40.73 35.08,40.73 v2(35.01,40.66)
  Bottom Layer w0.254: 57.88,73.65 57.07,73.65 56.75,73.32 56.75,45.32 55.41,43.99 49.13,43.99 v2(45.87,40.72) ; K100.9 25.35,33.57 32.45,40.66 v2(35.01,40.66)
LO-TRIM: length 30.4
  Bottom Layer w0.254: 67.37,88.16 83.78,71.75 87.96,71.75 CN101.6 ; C106.1 69.77,88.16 U101.4
NC-GPIO: length 2.5
  Bottom Layer w0.254: R104.1 22.72,45.02 IN100.6
NOISY-5V: length 317.6
  Inner2 w0.342: K100.10 K100.1 ; K102.1 K102.3 ; K101.1 K101.10
  Inner2 w0.75: v1(60.11,72.69) 62.3,72.69 67.12,67.87 U101.12
  Inner2 w1: 35.29,47.39 35.25,47.39 IN100.10 ; 35.29,47.39 46.31,36.37 60.04,36.37 50.34,26.67 32.97,26.67 ; 35.29,47.39 15.22,67.46 CN100.11 ; K101.1 60.05,34.96 60.05,36.37 ; 60,36.42 55.7,40.73 49.82,40.73 42.09,48.47 42.09,69.56 v1(39.75,69.56) 37.76,69.56 U104.10 37.78,69.64 42.2,74.06 42.2,93.52 v1(41.85,93.52) U102.10 ; 81.24,81.94 81.24,85.29 ; U101.12 72.88,67.84
  Inner2 w1.5: CN100.11 13.28,67.47 13.28,69.99 CN100.13 CN100.15 ; 73.11,57.66 73.11,67.64 81.24,75.77 81.24,81.94 v1(85.08,81.94) 86.97,81.94 ; K102.1 v1(63.71,48.26) 60.02,44.57 v1(60.02,42.52) 60.02,36.44 60,36.42 C115.1 ; CN102.7 CN102.8
  Bottom Layer w0.254: 72.25,18.92 73.51,18.92 K101.1 ; U105.1 60.15,36.28 C115.1 ; K102.1 72.52,57.07 D101.1 ; D100.1 35.77,26.91 35.57,26.72 33.02,26.72 K100.1
  vias: v1(38.05,26.62) v1(39.7,93.54) v1(41.82,69.56) v1(72.48,22.51) v1(73.14,60.01) v1(83.02,81.95)
PA-12V: length 3.7
  Bottom Layer w0.254: R106.2 10.73,52.64 CN100.2
PA-ENABLE: length 50.7
  Top Layer w0.254: v2(55.43,45.93) 65.34,45.93 v2(66.76,44.51)
  Bottom Layer w0.254: R109.1 72.23,39.04 v2(66.76,44.51) ; v2(55.43,45.93) 41.2,45.93 40.13,47 40.13,57.03 37.67,59.49
PA-ENABLE-2: length 13.8
  Bottom Layer w0.254: CN103.2 74.88,36.58 R109.2
PA-IN-SENSE: length 66.5
  Top Layer w0.254: v2(63.24,44.66) 67.41,40.5 v2(67.41,12.24)
  Bottom Layer w0.254: 57.88,71.75 57.63,71.49 57.63,45.51 58.48,44.66 v2(63.24,44.66)
PA-INPUT: length 5.8
  Top Layer w0.157: SMA106.5 90.26,28 U106.13
PA-INPUT-TERMINATION: length 2.7
  Bottom Layer w0.157: K101.3 79.88,22.87
PA-OUT-SENSE: length 24.2
  Bottom Layer w0.254: R112.1 77.65,62.64 68.62,71.67 60.25,71.67 U103.6
PA-OUTPUT: length 15
  Top Layer w0.157: SMA107.5 90.89,58 85.47,52.58 83.27,52.58
PA-PREAMP-IN: length 3.6
  Top Layer w0.157: X100.1 82.42,23.8 K101.4
PA-PREAMP-OUT: length 9.1
  Top Layer w0.157: v1(82.41,26.8) 85.04,26.8 86.21,27.97 U106.6
  Bottom Layer w0.157: R113.1 80.83,28.37 v1(82.41,26.8)
RLY-1-EN: length 27.3
  Top Layer w0.342: v2(31.07,77.72) 31.63,78.28 U102.16
  Bottom Layer w0.254: v2(31.07,77.72) 31.07,75.08 CN100.17
RLY-2-EN: length 25.2
  Top Layer w0.342: v2(29.31,77.62) 31.19,75.74 U102.17
  Bottom Layer w0.254: 13.27,77.62 v2(29.31,77.62)
RLY-3-EN: length 29.4
  Top Layer w0.342: v2(28.06,80.15) 28.06,76.46 31.32,73.2 37.67,73.2
  Bottom Layer w0.254: v2(28.06,80.15) 13.28,80.15 CN100.21
RLY-4-EN: length 34.5
  Top Layer w0.342: U104.11 35.9,67.11 26.46,76.55 v2(26.46,82.7)
  Bottom Layer w0.254: 13.27,82.7 v2(26.46,82.7)
RLY-5-EN: length 37.8
  Top Layer w0.342: U104.12 37.17,64.56 24.83,76.9 v2(24.83,85.23)
  Bottom Layer w0.254: v2(24.83,85.23) 13.28,85.23 CN100.25
RLY-6-EN: length 40
  Top Layer w0.342: U102.15 32.52,80.82 v2(31.96,80.26)
  Bottom Layer w0.254: CN100.9 31.96,64.92 v2(31.96,80.26)
RLY-7-EN: length 45.1
  Top Layer w0.342: U102.14 33.41,83.36 v2(32.85,82.8)
  Bottom Layer w0.254: v2(32.85,82.8) 32.85,62.38 CN100.7
RLY-8-EN: length 50.1
  Top Layer w0.342: v2(33.61,85.34) 34.17,85.9 37.67,85.9
  Bottom Layer w0.254: v2(33.61,85.34) 33.61,59.84 CN100.5
RLY-9-EN: length 55.2
  Top Layer w0.342: v2(34.37,87.88) 34.93,88.44 U102.12
  Bottom Layer w0.254: v2(34.37,87.88) 34.37,57.3 CN100.3
RLY-10-EN: length 60.6
  Bottom Layer w0.254: 37.67,90.98 37.57,90.87 35.18,90.87 35.18,54.76 CN100.1
RLY-TXRX-EN: length 144.2
  Top Layer w0.254: v1(67.05,46.54) 67.53,47.01 67.53,47.01 70.39,49.87 70.39,49.87 73.09,52.58 K102.12
  Bottom Layer w0.254: 74.78,15.11 K101.12 63.18,15.14 49.18,29.14 49.18,39.29 ; 36.28,39.29 49.18,39.29 ; 36.28,39.29 36.28,60.63 U104.13 ; 36.28,39.29 36.28,35.05 33.45,32.23 ; 49.18,39.29 59.82,39.29 67.05,46.52 v1(67.05,46.54) ; D101.2 72.01,53.67 73.11,52.58 76.03,55.5 76.03,59.36 78.31,61.64 83.94,61.64 CN101.4 ; 33.45,32.23 K100.12 ; 33.45,32.23 D100.2
SPI-CLK: length 77.5
  Top Layer w0.157: v1(79.96,37.34) 79.96,35.94 85.92,29.97 U106.2 ; v1(63.01,60.66) 63.01,91.67 67.12,95.78
  Bottom Layer w0.157: v1(63.01,60.66) 63.01,55.74 79.96,38.79 v1(79.96,37.34)
SPI-CS1: length 67.1
  Top Layer w0.157: v1(82.07,35.87) 82.07,37.28 v1(82.06,37.28) ; U106.4 83.11,28.97 v1(80.67,31.41) ; U101.6 64.82,80.78 64.82,60.77 v1(64.78,60.74)
  Bottom Layer w0.157: v1(80.67,31.41) 80.67,32.89 82.07,34.28 v1(82.07,35.87) ; v1(82.06,37.28) 82.06,39.1 64.78,56.38 v1(64.78,60.74)
SPI-MOSI: length 79.2
  Top Layer w0.157: U106.3 84.46,29.47 78.69,35.25 v1(78.69,37.35) ; U101.29 61.26,83.86 v1(61.26,60.04)
  Bottom Layer w0.157: v1(61.26,60.04) 61.26,54.77 v1(78.69,37.35)
TO-ANTENNA: length 10.6
  Top Layer w0.157: OUT100.4 OUT100.3 15.08,8.85 U107.2 14.97,4.03 SMA105.1
TO-BPF: length 26.7
  Bottom Layer w0.157: SMA101.5 23.05,20 25.35,22.31 25.35,26.67
TO-LO: length 48
  Top Layer w0.157: K100.5 22.81,19.09 37.75,4.16 37.76,4.16 37.79,4.13 49.95,4.13 ; R100.2 51.69,9.44 R101.2 50,9.39 SMA100.5
TO-LPF: length 18.4
  Top Layer w0.157: SMA103.5 88.31,45 80.73,52.58

## Copper pours and planes (outline as drawn; the poured copper is in the pictures)
GND on Top Layer: 0,100 100,100 100,0 0,0
GND on Bottom Layer: 59.39,61.96 99.95,61.96 99.95,-0.05 59.39,-0.05
GND on Bottom Layer: 0,54.6 60.13,54.6 60.13,0 0,0
GND on Inner1: 100,0 -1.04,1.31 -0.96,101.51 98.99,101.51
GND on Inner2: -0.05,100.1 99.9,99.97 99.9,0.15 -0.05,0.15

Small or netless copper shapes (teardrops, artwork), in the pictures only: 1 on Top Layer

## Text on the board
Bottom Silkscreen Layer: Use R105 for input / voltage monitoring / Use R104 for extra GPIO
Top Silkscreen Layer: 1  2  3  4 | Connect to the SMA labeled IN / on the LPF board | Connect LPF filter / to pins 1-4 | Connect to the SMA labeled OUT / on the LPF board
